# Altium schematic sheet Bus_Capacitors.SchDoc: Bus Capacitors
size A4; CompanyName: TM; DrawnBy: Juan Tinazzo; DocumentNumber: 1; Revision: 1; SheetNumber: 2; SheetTotal: 4; Number: 25
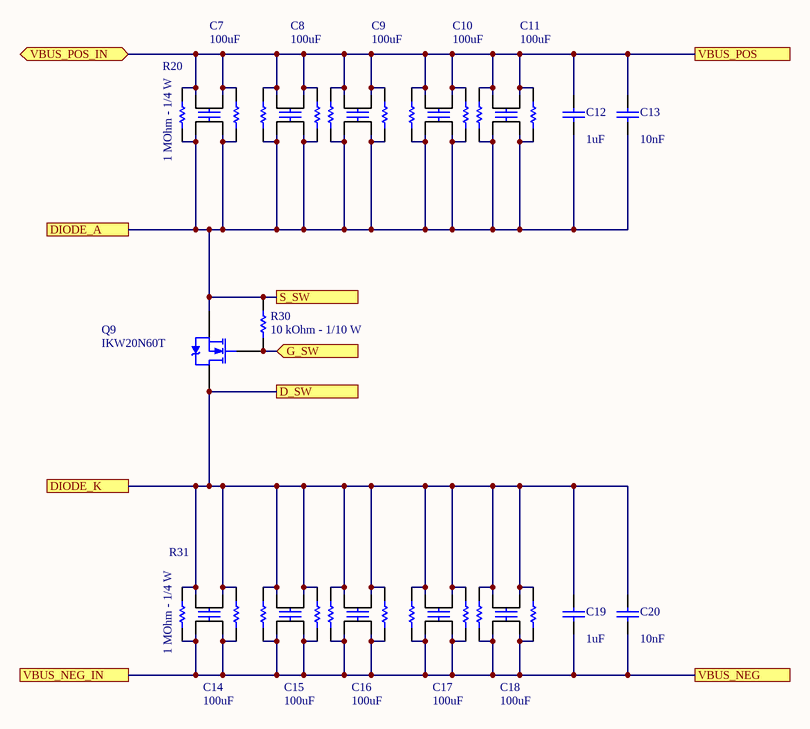
[diagram p0: Bus_Capacitors.SchDoc]

## Parts
C7  value 100uF  [MKP DC link - High density series]  (hidden comment: EPCOS B32778G4107)
C8  value 100uF  [MKP DC link - High density series]  (hidden comment: EPCOS B32778G4107)
C9  value 100uF  [MKP DC link - High density series]  (hidden comment: EPCOS B32778G4107)
C10  value 100uF  [MKP DC link - High density series]  (hidden comment: EPCOS B32778G4107)
C11  value 100uF  [MKP DC link - High density series]  (hidden comment: EPCOS B32778G4107)
C12  value 1uF  [MKP PITCH:27.5mm SIZE:13.5mmx31.5mm]  (hidden comment: EPCOS B32654A6105)
C13  value 10nF  [MKP PITCH:15mm SIZE:5mmx18mm]  (hidden comment: EPCOS B32652A0103)
C14  value 100uF  [MKP DC link - High density series]  (hidden comment: EPCOS B32778G4107)
C15  value 100uF  [MKP DC link - High density series]  (hidden comment: EPCOS B32778G4107)
C16  value 100uF  [MKP DC link - High density series]  (hidden comment: EPCOS B32778G4107)
C17  value 100uF  [MKP DC link - High density series]  (hidden comment: EPCOS B32778G4107)
C18  value 100uF  [MKP DC link - High density series]  (hidden comment: EPCOS B32778G4107)
C19  value 1uF  [MKP PITCH:27.5mm SIZE:13.5mmx31.5mm]  (hidden comment: EPCOS B32654A6105)
C20  value 10nF  [MKP PITCH:15mm SIZE:5mmx18mm]  (hidden comment: EPCOS B32652A0103)
Q9  IKW20N60T  [TO-247 Horiz. Heatsink]
R20  value 1 MOhm - 1/4 W  [RESC3216X60N]  (hidden comment: THT)
R21  THT  [RESC3216X60N]  (value not drawn)
R22  THT  [RESC3216X60N]  (value not drawn)
R23  THT  [RESC3216X60N]  (value not drawn)
R24  THT  [RESC3216X60N]  (value not drawn)
R25  THT  [RESC3216X60N]  (value not drawn)
R26  THT  [RESC3216X60N]  (value not drawn)
R27  THT  [RESC3216X60N]  (value not drawn)
R28  THT  [RESC3216X60N]  (value not drawn)
R29  THT  [RESC3216X60N]  (value not drawn)
R30  value 10 kOhm - 1/10 W  [RESC1608X50N]  (hidden comment: CRCW060310K0FKEA)
R31  value 1 MOhm - 1/4 W  [RESC3216X60N]  (hidden comment: THT)
R32  THT  [RESC3216X60N]  (value not drawn)
R33  THT  [RESC3216X60N]  (value not drawn)
R34  THT  [RESC3216X60N]  (value not drawn)
R35  THT  [RESC3216X60N]  (value not drawn)
R36  THT  [RESC3216X60N]  (value not drawn)
R37  THT  [RESC3216X60N]  (value not drawn)
R38  THT  [RESC3216X60N]  (value not drawn)
R39  THT  [RESC3216X60N]  (value not drawn)
R40  THT  [RESC3216X60N]  (value not drawn)

## Ports
D_SW, DIODE_A, DIODE_K, G_SW (in), S_SW, VBUS_NEG, VBUS_NEG_IN, VBUS_POS, VBUS_POS_IN (bidir)

## Nets
D_SW: C14.1 C14.2 C15.1 C15.2 C16.1 C16.2 C17.1 C17.2 C18.1 C18.2 C19.2 C20.2 Q9.2(D) R31.2 R32.2 R33.2 R34.2 R35.2 R36.2 R37.2 R38.2 R39.2 R40.2 ; port DIODE_K, port D_SW
DIODE_A: C7.3 C7.4 C8.3 C8.4 C9.3 C9.4 C10.3 C10.4 C11.3 C11.4 C12.1 C13.2 Q9.3(S) R20.1 R21.1 R22.1 R23.1 R24.1 R25.1 R26.1 R27.1 R28.1 R29.1 R30.2 ; port DIODE_A, port S_SW
G_SW: Q9.1(G) R30.1 ; port G_SW
VBUS_NEG: C14.3 C14.4 C15.3 C15.4 C16.3 C16.4 C17.3 C17.4 C18.3 C18.4 C19.1 C20.1 R31.1 R32.1 R33.1 R34.1 R35.1 R36.1 R37.1 R38.1 R39.1 R40.1 ; port VBUS_NEG, port VBUS_NEG_IN
VBUS_POS: C7.1 C7.2 C8.1 C8.2 C9.1 C9.2 C10.1 C10.2 C11.1 C11.2 C12.2 C13.1 R20.2 R21.2 R22.2 R23.2 R24.2 R25.2 R26.2 R27.2 R28.2 R29.2 ; port VBUS_POS_IN, port VBUS_POS

## Notes on the sheet
- Title
- Size:
- Project:
- A4
- Number:
- Revision:
- Sheet
- of
- Drawn by:
- Company:
- File:

## Library data of the parts
C7-C11 C14-C18 = EPCOS B32778G4107: MKP DC link - High density series - 100uF 450V; Published: 8-Jun-2000; LatestRevisionDate: 17-Jul-2002; LatestRevisionNote: Re-released for DXP Platform.; PackageReference: RAD-0.3; Publisher: Altium Limited; PackageDescription: Radial Cap, Thru-Hole; 2 Leads; 0.3 in Pin Spacing
C12 C19 = EPCOS B32654A6105: MKP High pulse (wound) 1uF 630Vdc; Published: 8-Jun-2000; LatestRevisionDate: 17-Jul-2002; LatestRevisionNote: Re-released for DXP Platform.; PackageReference: RAD-0.3; Publisher: Altium Limited; PackageDescription: Radial Cap, Thru-Hole; 2 Leads; 0.3 in Pin Spacing
C13 C20 = EPCOS B32652A0103: MKP High pulse (wound) 10nF 1000Vdc; Published: 8-Jun-2000; LatestRevisionDate: 17-Jul-2002; LatestRevisionNote: Re-released for DXP Platform.; PackageReference: RAD-0.3; Publisher: Altium Limited; PackageDescription: Radial Cap, Thru-Hole; 2 Leads; 0.3 in Pin Spacing
Q9 = IPx65R110CFD: IGBTs LOW LOSS DuoPack 600V 20A; Published: 17-Sep-2003; DatasheetVersion: 13-Jul-2001; PackageVersion: 16-Sep-2002; PackageReference: SMD-0.5; Publisher: Altium Limited; PackageDescription: SM; 3 Leadless Terminals; Body 10.28 x 7.64 x 3.06 mm (LxWxH); ComponentLink1Description: Manufacturer Link; ComponentLink1URL: http://www.irf.com/; ComponentLink2Description: Datasheet; ComponentLink2URL: http://www.irf.com/product-info/datasheets/data/IRHN7150.pdf
R20 R31 = CRCW1206220KFKEA: Resistor; Manufacturer_Name: Vishay; Datasheet Link: http://www.vishay.com/docs/20035/dcrcwe3.pdf; Height: 0.6mm; Manufacturer_Part_Number: THT; Mouser Part Number: 71-CRCW1206-220K-E3; Mouser Price/Stock: https://www.mouser.co.uk/ProductDetail/Vishay-Dale/CRCW1206220KFKEA?qs=bSMkur10BccuQYiNrhxgBA%3D%3D
R21-R29 R32-R40 = CRCW1206220KFKEA: Resistor; Manufacturer_Name: Vishay; Value: 1 MOhm - 1/4 W; Datasheet Link: http://www.vishay.com/docs/20035/dcrcwe3.pdf; Height: 0.6mm; Manufacturer_Part_Number: THT; Mouser Part Number: 71-CRCW1206-220K-E3; Mouser Price/Stock: https://www.mouser.co.uk/ProductDetail/Vishay-Dale/CRCW1206220KFKEA?qs=bSMkur10BccuQYiNrhxgBA%3D%3D
R30 = CRCW060310K0FKEA: Resistor; Manufacturer_Name: Vishay; Datasheet Link: http://www.vishay.com/docs/20035/dcrcwe3.pdf; Height: 0.5mm; Manufacturer_Part_Number: CRCW060310K0FKEA; Mouser Part Number: 71-CRCW0603-10K-E3; Mouser Price/Stock: https://www.mouser.co.uk/ProductDetail/Vishay-Dale/CRCW060310K0FKEA?qs=pAO1Z172M84BVnhDjtnsoQ%3D%3D; Arrow Part Number: CRCW060310K0FKEA; Arrow Price/Stock: https://www.arrow.com/en/products/crcw060310k0fkea/vishay?region=nac